# EAGLE design Backplane-3 (EAGLE 7.4.0)

## Sheet 1 of 3
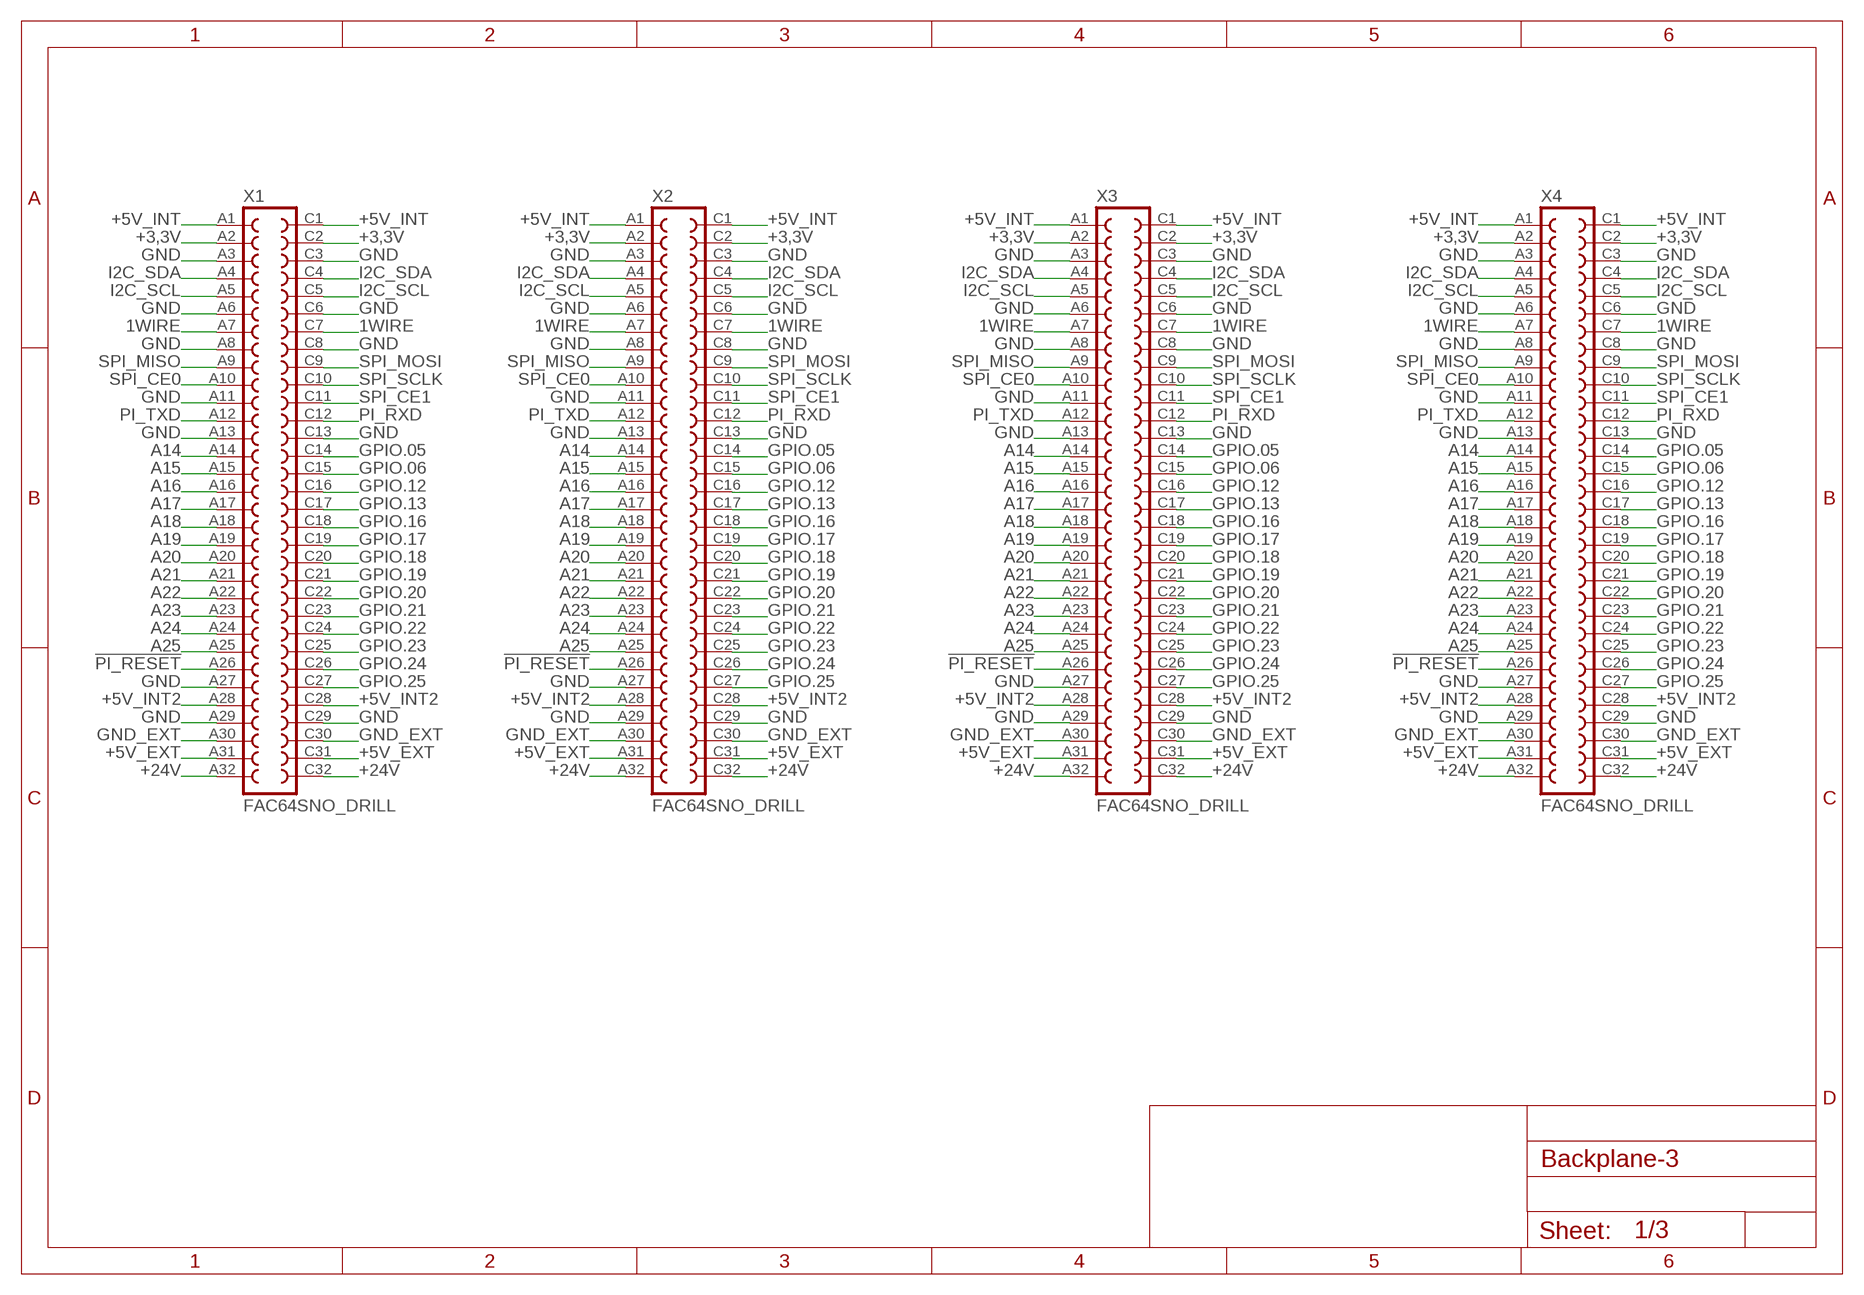
[diagram p0: schematic, sheet 1]

### Parts
X1  FAC64SNO_DRILL  [FAC64S_NO_DRILL]
X2  FAC64SNO_DRILL  [FAC64S_NO_DRILL]
X3  FAC64SNO_DRILL  [FAC64S_NO_DRILL]
X4  FAC64SNO_DRILL  [FAC64S_NO_DRILL]

### Nets
1WIRE: X1.A7 X1.C7 X2.A7 X2.C7 X3.A7 X3.C7 X4.A7 X4.C7 ; also sheet 2,3
!PI_RESET: X1.A26 X2.A26 X3.A26 X4.A26 ; also sheet 2,3
+3,3V: X1.A2 X1.C2 X2.A2 X2.C2 X3.A2 X3.C2 X4.A2 X4.C2 ; also sheet 2,3
+5V_EXT: X1.A31 X1.C31 X2.A31 X2.C31 X3.A31 X3.C31 X4.A31 X4.C31 ; also sheet 2,3
+5V_INT: X1.A1 X1.C1 X2.A1 X2.C1 X3.A1 X3.C1 X4.A1 X4.C1 ; also sheet 2,3
+5V_INT2: X1.A28 X1.C28 X2.A28 X2.C28 X3.A28 X3.C28 X4.A28 X4.C28 ; also sheet 2,3
+24V [24V]: X1.A32 X1.C32 X2.A32 X2.C32 X3.A32 X3.C32 X4.A32 X4.C32 ; also sheet 2,3
A14: X1.A14 X2.A14 X3.A14 X4.A14 ; also sheet 2,3
A15: X1.A15 X2.A15 X3.A15 X4.A15 ; also sheet 2,3
A16: X1.A16 X2.A16 X3.A16 X4.A16 ; also sheet 2,3
A17: X1.A17 X2.A17 X3.A17 X4.A17 ; also sheet 2,3
A18: X1.A18 X2.A18 X3.A18 X4.A18 ; also sheet 2,3
A19: X1.A19 X2.A19 X3.A19 X4.A19 ; also sheet 2,3
A20: X1.A20 X2.A20 X3.A20 X4.A20 ; also sheet 2,3
A21: X1.A21 X2.A21 X3.A21 X4.A21 ; also sheet 2,3
A22: X1.A22 X2.A22 X3.A22 X4.A22 ; also sheet 2,3
A23: X1.A23 X2.A23 X3.A23 X4.A23 ; also sheet 2,3
A24: X1.A24 X2.A24 X3.A24 X4.A24 ; also sheet 2,3
A25: X1.A25 X2.A25 X3.A25 X4.A25 ; also sheet 2,3
GND: X1.A3 X1.A6 X1.A8 X1.A11 X1.A13 X1.A27 X1.A29 X1.C3 X1.C6 X1.C8 X1.C13 X1.C29 X2.A3 X2.A6 X2.A8 X2.A11 X2.A13 X2.A27 X2.A29 X2.C3 X2.C6 X2.C8 X2.C13 X2.C29 X3.A3 X3.A6 X3.A8 X3.A11 X3.A13 X3.A27 X3.A29 X3.C3 X3.C6 X3.C8 X3.C13 X3.C29 X4.A3 X4.A6 X4.A8 X4.A11 X4.A13 X4.A27 X4.A29 X4.C3 X4.C6 X4.C8 X4.C13 X4.C29 ; also sheet 2,3
GND_EXT: X1.A30 X1.C30 X2.A30 X2.C30 X3.A30 X3.C30 X4.A30 X4.C30 ; also sheet 2,3
GPIO.05: X1.C14 X2.C14 X3.C14 X4.C14 ; also sheet 2,3
GPIO.06: X1.C15 X2.C15 X3.C15 X4.C15 ; also sheet 2,3
GPIO.12: X1.C16 X2.C16 X3.C16 X4.C16 ; also sheet 2,3
GPIO.13: X1.C17 X2.C17 X3.C17 X4.C17 ; also sheet 2,3
GPIO.16: X1.C18 X2.C18 X3.C18 X4.C18 ; also sheet 2,3
GPIO.17: X1.C19 X2.C19 X3.C19 X4.C19 ; also sheet 2,3
GPIO.18: X1.C20 X2.C20 X3.C20 X4.C20 ; also sheet 2,3
GPIO.19: X1.C21 X2.C21 X3.C21 X4.C21 ; also sheet 2,3
GPIO.20: X1.C22 X2.C22 X3.C22 X4.C22 ; also sheet 2,3
GPIO.21: X1.C23 X2.C23 X3.C23 X4.C23 ; also sheet 2,3
GPIO.22: X1.C24 X2.C24 X3.C24 X4.C24 ; also sheet 2,3
GPIO.23: X1.C25 X2.C25 X3.C25 X4.C25 ; also sheet 2,3
GPIO.24: X1.C26 X2.C26 X3.C26 X4.C26 ; also sheet 2,3
GPIO.25: X1.C27 X2.C27 X3.C27 X4.C27 ; also sheet 2,3
I2C_SCL: X1.A5 X1.C5 X2.A5 X2.C5 X3.A5 X3.C5 X4.A5 X4.C5 ; also sheet 2,3
I2C_SDA: X1.A4 X1.C4 X2.A4 X2.C4 X3.A4 X3.C4 X4.A4 X4.C4 ; also sheet 2,3
PI_RXD: X1.C12 X2.C12 X3.C12 X4.C12 ; also sheet 2,3
PI_TXD: X1.A12 X2.A12 X3.A12 X4.A12 ; also sheet 2,3
SPI_CE0: X1.A10 X2.A10 X3.A10 X4.A10 ; also sheet 2,3
SPI_CE1: X1.C11 X2.C11 X3.C11 X4.C11 ; also sheet 2,3
SPI_MISO: X1.A9 X2.A9 X3.A9 X4.A9 ; also sheet 2,3
SPI_MOSI: X1.C9 X2.C9 X3.C9 X4.C9 ; also sheet 2,3
SPI_SCLK: X1.C10 X2.C10 X3.C10 X4.C10 ; also sheet 2,3

## Sheet 2 of 3
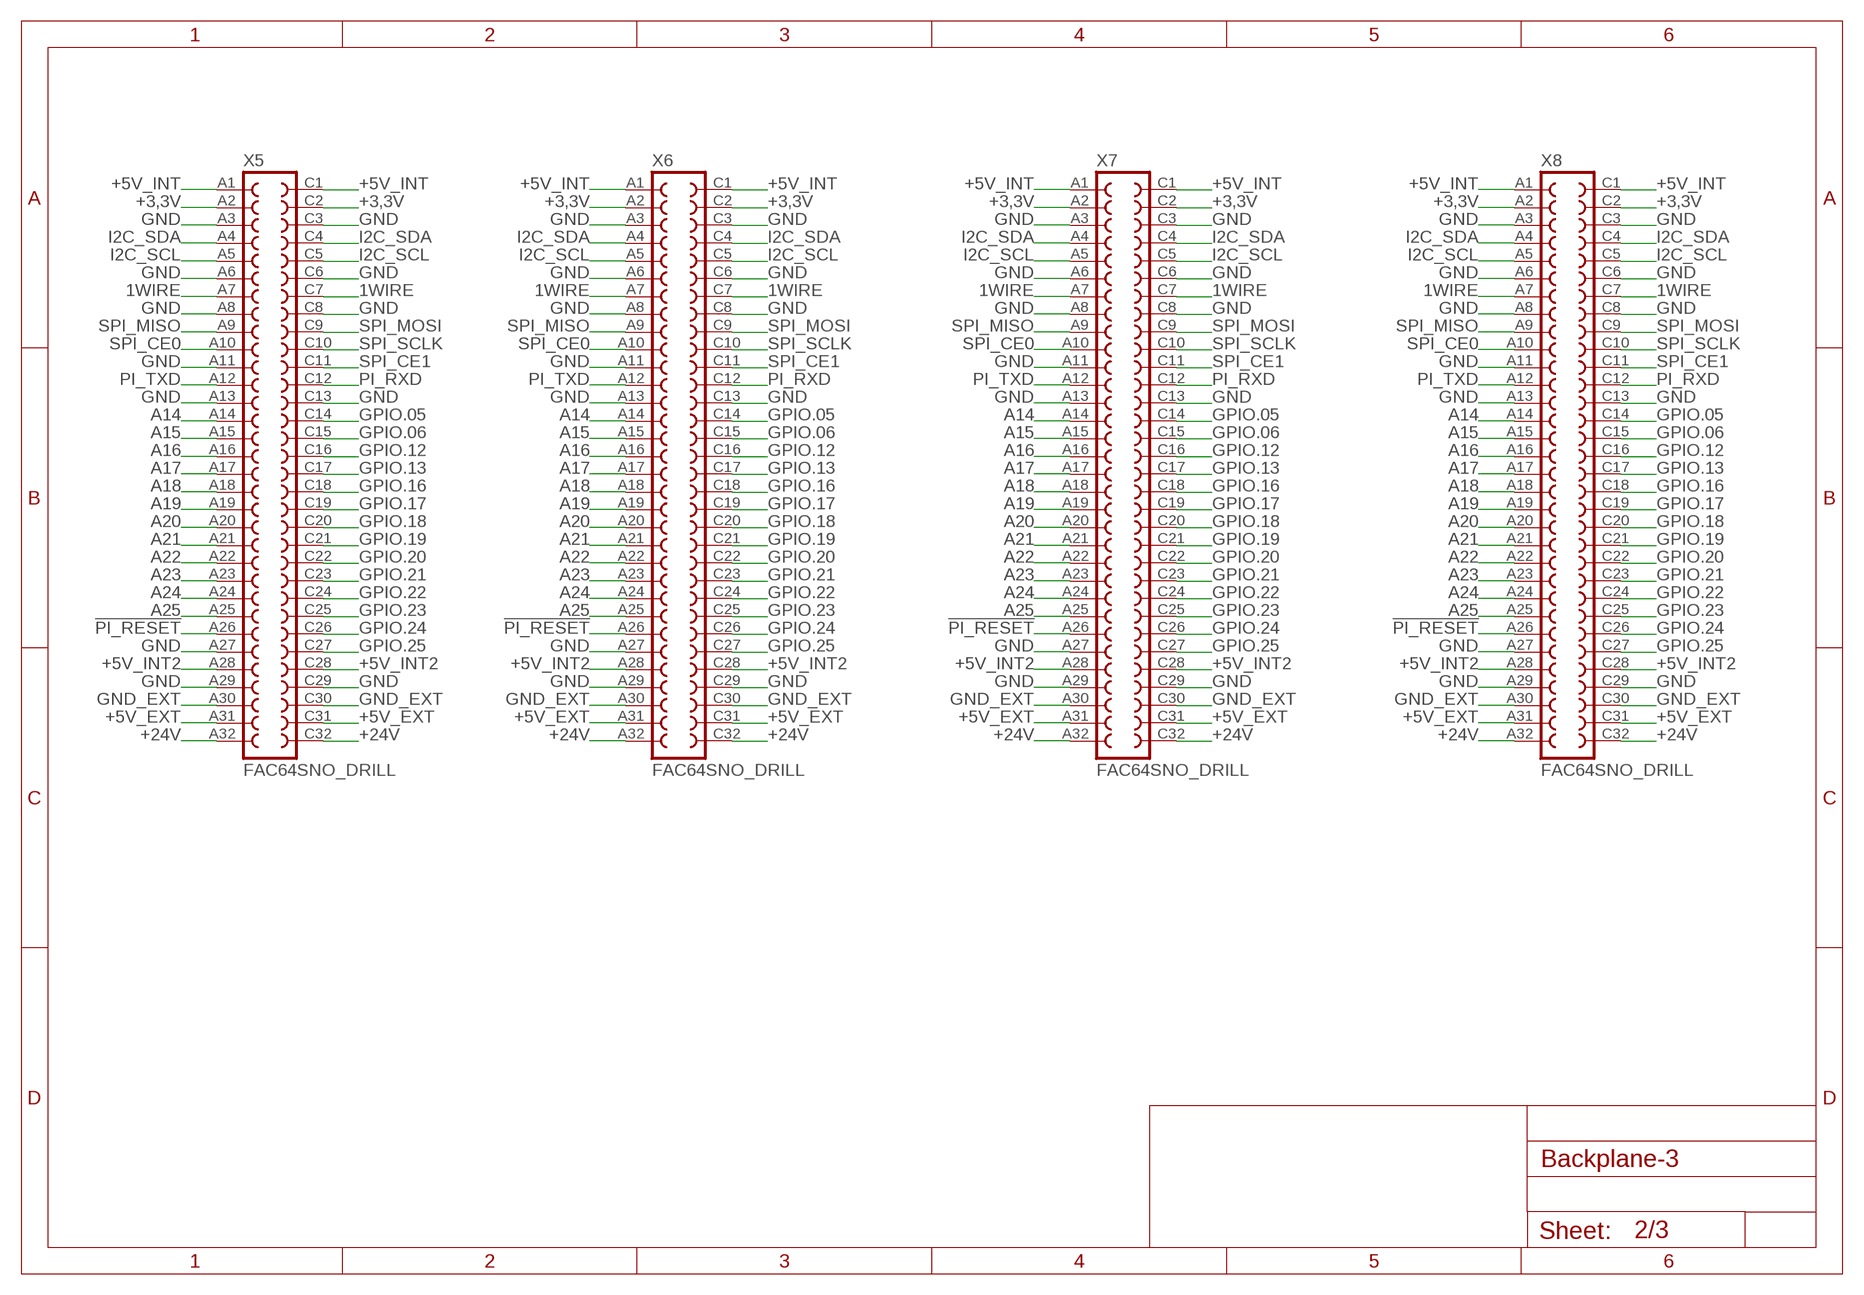
[diagram p1: schematic, sheet 2]

### Parts
X5  FAC64SNO_DRILL  [FAC64S_NO_DRILL]
X6  FAC64SNO_DRILL  [FAC64S_NO_DRILL]
X7  FAC64SNO_DRILL  [FAC64S_NO_DRILL]
X8  FAC64SNO_DRILL  [FAC64S_NO_DRILL]

### Nets
1WIRE: X5.A7 X5.C7 X6.A7 X6.C7 X7.A7 X7.C7 X8.A7 X8.C7 ; also sheet 1,3
!PI_RESET: X5.A26 X6.A26 X7.A26 X8.A26 ; also sheet 1,3
+3,3V: X5.A2 X5.C2 X6.A2 X6.C2 X7.A2 X7.C2 X8.A2 X8.C2 ; also sheet 1,3
+5V_EXT: X5.A31 X5.C31 X6.A31 X6.C31 X7.A31 X7.C31 X8.A31 X8.C31 ; also sheet 1,3
+5V_INT: X5.A1 X5.C1 X6.A1 X6.C1 X7.A1 X7.C1 X8.A1 X8.C1 ; also sheet 1,3
+5V_INT2: X5.A28 X5.C28 X6.A28 X6.C28 X7.A28 X7.C28 X8.A28 X8.C28 ; also sheet 1,3
+24V [24V]: X5.A32 X5.C32 X6.A32 X6.C32 X7.A32 X7.C32 X8.A32 X8.C32 ; also sheet 1,3
A14: X5.A14 X6.A14 X7.A14 X8.A14 ; also sheet 1,3
A15: X5.A15 X6.A15 X7.A15 X8.A15 ; also sheet 1,3
A16: X5.A16 X6.A16 X7.A16 X8.A16 ; also sheet 1,3
A17: X5.A17 X6.A17 X7.A17 X8.A17 ; also sheet 1,3
A18: X5.A18 X6.A18 X7.A18 X8.A18 ; also sheet 1,3
A19: X5.A19 X6.A19 X7.A19 X8.A19 ; also sheet 1,3
A20: X5.A20 X6.A20 X7.A20 X8.A20 ; also sheet 1,3
A21: X5.A21 X6.A21 X7.A21 X8.A21 ; also sheet 1,3
A22: X5.A22 X6.A22 X7.A22 X8.A22 ; also sheet 1,3
A23: X5.A23 X6.A23 X7.A23 X8.A23 ; also sheet 1,3
A24: X5.A24 X6.A24 X7.A24 X8.A24 ; also sheet 1,3
A25: X5.A25 X6.A25 X7.A25 X8.A25 ; also sheet 1,3
GND: X5.A3 X5.A6 X5.A8 X5.A11 X5.A13 X5.A27 X5.A29 X5.C3 X5.C6 X5.C8 X5.C13 X5.C29 X6.A3 X6.A6 X6.A8 X6.A11 X6.A13 X6.A27 X6.A29 X6.C3 X6.C6 X6.C8 X6.C13 X6.C29 X7.A3 X7.A6 X7.A8 X7.A11 X7.A13 X7.A27 X7.A29 X7.C3 X7.C6 X7.C8 X7.C13 X7.C29 X8.A3 X8.A6 X8.A8 X8.A11 X8.A13 X8.A27 X8.A29 X8.C3 X8.C6 X8.C8 X8.C13 X8.C29 ; also sheet 1,3
GND_EXT: X5.A30 X5.C30 X6.A30 X6.C30 X7.A30 X7.C30 X8.A30 X8.C30 ; also sheet 1,3
GPIO.05: X5.C14 X6.C14 X7.C14 X8.C14 ; also sheet 1,3
GPIO.06: X5.C15 X6.C15 X7.C15 X8.C15 ; also sheet 1,3
GPIO.12: X5.C16 X6.C16 X7.C16 X8.C16 ; also sheet 1,3
GPIO.13: X5.C17 X6.C17 X7.C17 X8.C17 ; also sheet 1,3
GPIO.16: X5.C18 X6.C18 X7.C18 X8.C18 ; also sheet 1,3
GPIO.17: X5.C19 X6.C19 X7.C19 X8.C19 ; also sheet 1,3
GPIO.18: X5.C20 X6.C20 X7.C20 X8.C20 ; also sheet 1,3
GPIO.19: X5.C21 X6.C21 X7.C21 X8.C21 ; also sheet 1,3
GPIO.20: X5.C22 X6.C22 X7.C22 X8.C22 ; also sheet 1,3
GPIO.21: X5.C23 X6.C23 X7.C23 X8.C23 ; also sheet 1,3
GPIO.22: X5.C24 X6.C24 X7.C24 X8.C24 ; also sheet 1,3
GPIO.23: X5.C25 X6.C25 X7.C25 X8.C25 ; also sheet 1,3
GPIO.24: X5.C26 X6.C26 X7.C26 X8.C26 ; also sheet 1,3
GPIO.25: X5.C27 X6.C27 X7.C27 X8.C27 ; also sheet 1,3
I2C_SCL: X5.A5 X5.C5 X6.A5 X6.C5 X7.A5 X7.C5 X8.A5 X8.C5 ; also sheet 1,3
I2C_SDA: X5.A4 X5.C4 X6.A4 X6.C4 X7.A4 X7.C4 X8.A4 X8.C4 ; also sheet 1,3
PI_RXD: X5.C12 X6.C12 X7.C12 X8.C12 ; also sheet 1,3
PI_TXD: X5.A12 X6.A12 X7.A12 X8.A12 ; also sheet 1,3
SPI_CE0: X5.A10 X6.A10 X7.A10 X8.A10 ; also sheet 1,3
SPI_CE1: X5.C11 X6.C11 X7.C11 X8.C11 ; also sheet 1,3
SPI_MISO: X5.A9 X6.A9 X7.A9 X8.A9 ; also sheet 1,3
SPI_MOSI: X5.C9 X6.C9 X7.C9 X8.C9 ; also sheet 1,3
SPI_SCLK: X5.C10 X6.C10 X7.C10 X8.C10 ; also sheet 1,3

## Sheet 3 of 3
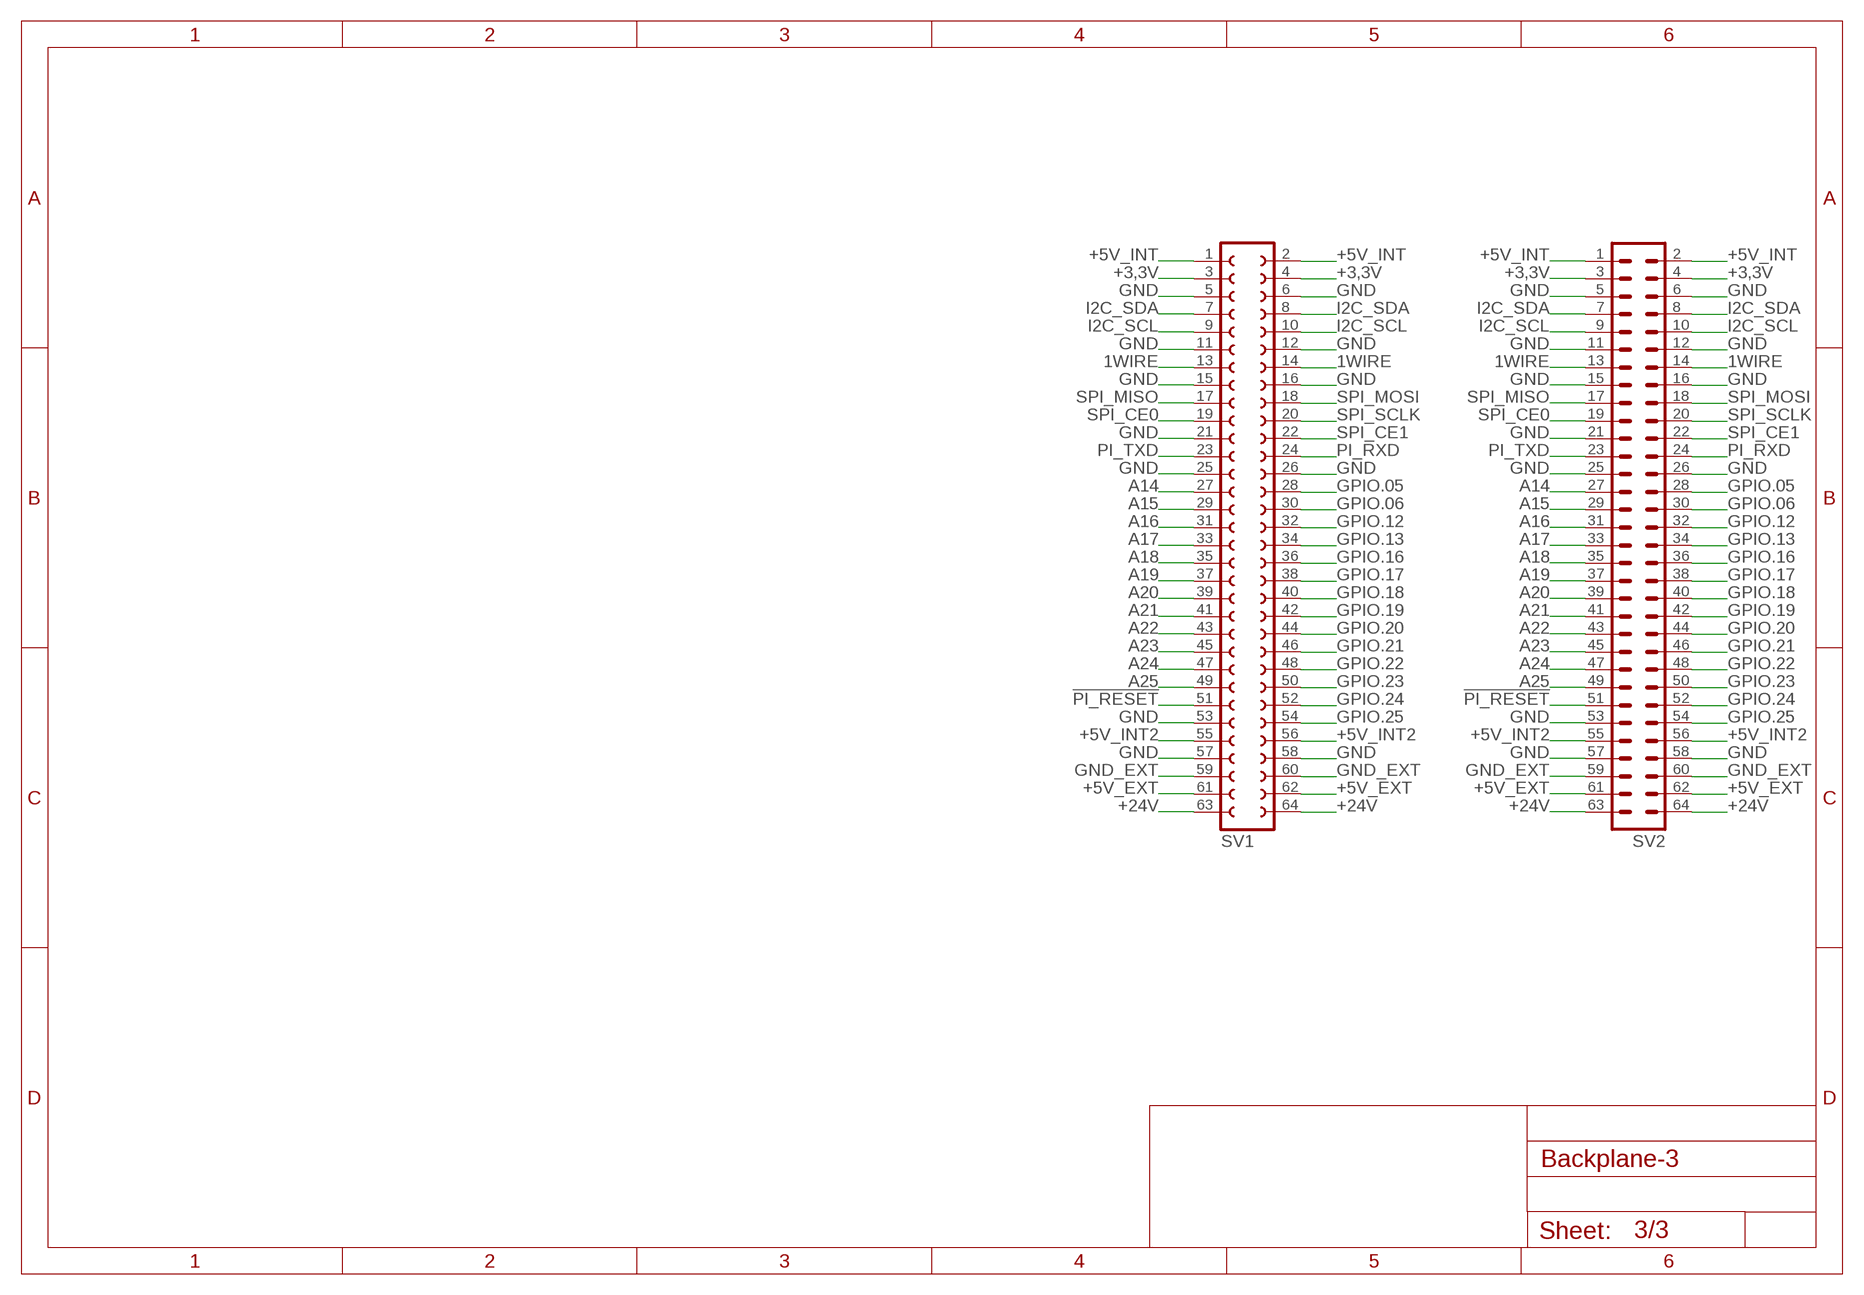
[diagram p2: schematic, sheet 3]

### Parts
SV1  FE32-2W  [FE32-2W]
SV2  MA32-2W  [MA32-2W]

### Nets
1WIRE: SV1.13 SV1.14 SV2.13 SV2.14 ; also sheet 1,2
!PI_RESET: SV1.51 SV2.51 ; also sheet 1,2
+3,3V: SV1.3 SV1.4 SV2.3 SV2.4 ; also sheet 1,2
+5V_EXT: SV1.61 SV1.62 SV2.61 SV2.62 ; also sheet 1,2
+5V_INT: SV1.1 SV1.2 SV2.1 SV2.2 ; also sheet 1,2
+5V_INT2: SV1.55 SV1.56 SV2.55 SV2.56 ; also sheet 1,2
+24V [24V]: SV1.63 SV1.64 SV2.63 SV2.64 ; also sheet 1,2
A14: SV1.27 SV2.27 ; also sheet 1,2
A15: SV1.29 SV2.29 ; also sheet 1,2
A16: SV1.31 SV2.31 ; also sheet 1,2
A17: SV1.33 SV2.33 ; also sheet 1,2
A18: SV1.35 SV2.35 ; also sheet 1,2
A19: SV1.37 SV2.37 ; also sheet 1,2
A20: SV1.39 SV2.39 ; also sheet 1,2
A21: SV1.41 SV2.41 ; also sheet 1,2
A22: SV1.43 SV2.43 ; also sheet 1,2
A23: SV1.45 SV2.45 ; also sheet 1,2
A24: SV1.47 SV2.47 ; also sheet 1,2
A25: SV1.49 SV2.49 ; also sheet 1,2
GND: SV1.5 SV1.6 SV1.11 SV1.12 SV1.15 SV1.16 SV1.21 SV1.25 SV1.26 SV1.53 SV1.57 SV1.58 SV2.5 SV2.6 SV2.11 SV2.12 SV2.15 SV2.16 SV2.21 SV2.25 SV2.26 SV2.53 SV2.57 SV2.58 ; also sheet 1,2
GND_EXT: SV1.59 SV1.60 SV2.59 SV2.60 ; also sheet 1,2
GPIO.05: SV1.28 SV2.28 ; also sheet 1,2
GPIO.06: SV1.30 SV2.30 ; also sheet 1,2
GPIO.12: SV1.32 SV2.32 ; also sheet 1,2
GPIO.13: SV1.34 SV2.34 ; also sheet 1,2
GPIO.16: SV1.36 SV2.36 ; also sheet 1,2
GPIO.17: SV1.38 SV2.38 ; also sheet 1,2
GPIO.18: SV1.40 SV2.40 ; also sheet 1,2
GPIO.19: SV1.42 SV2.42 ; also sheet 1,2
GPIO.20: SV1.44 SV2.44 ; also sheet 1,2
GPIO.21: SV1.46 SV2.46 ; also sheet 1,2
GPIO.22: SV1.48 SV2.48 ; also sheet 1,2
GPIO.23: SV1.50 SV2.50 ; also sheet 1,2
GPIO.24: SV1.52 SV2.52 ; also sheet 1,2
GPIO.25: SV1.54 SV2.54 ; also sheet 1,2
I2C_SCL: SV1.9 SV1.10 SV2.9 SV2.10 ; also sheet 1,2
I2C_SDA: SV1.7 SV1.8 SV2.7 SV2.8 ; also sheet 1,2
PI_RXD: SV1.24 SV2.24 ; also sheet 1,2
PI_TXD: SV1.23 SV2.23 ; also sheet 1,2
SPI_CE0: SV1.19 SV2.19 ; also sheet 1,2
SPI_CE1: SV1.22 SV2.22 ; also sheet 1,2
SPI_MISO: SV1.17 SV2.17 ; also sheet 1,2
SPI_MOSI: SV1.18 SV2.18 ; also sheet 1,2
SPI_SCLK: SV1.20 SV2.20 ; also sheet 1,2

## Library data of the parts
SV1 = 64-pol-verbinder:FE32-2W: FEMALE HEADER; OC_FARNELL: unknown; OC_NEWARK: unknown
SV2 = 64-pol-verbinder:MA32-2W: PIN HEADER; OC_FARNELL: unknown; OC_NEWARK: unknown
X1-X8 = my-con-vg:FAC64S: CONNECTOR female, 64 pins, block, type C, rows AC, grid 5.08 mm

## Net classes
1 24V: width 0.813 mm, clearance 0.406 mm

## Board
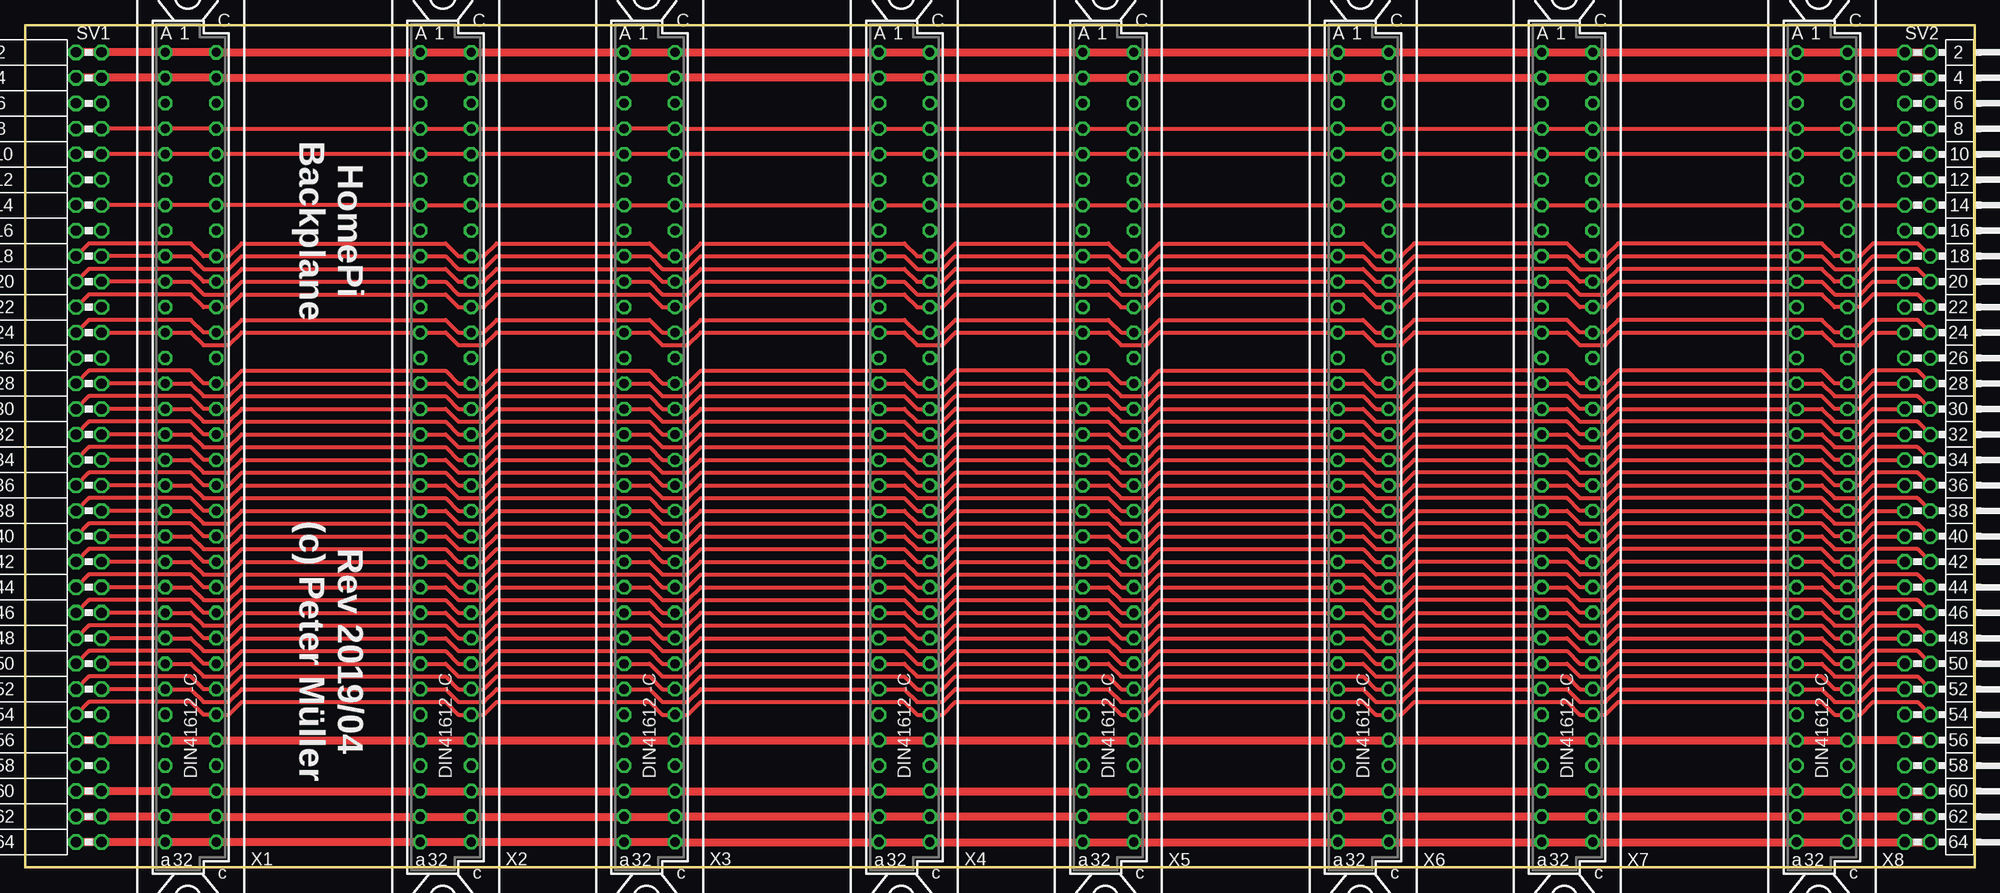
[diagram p3: board, top side]
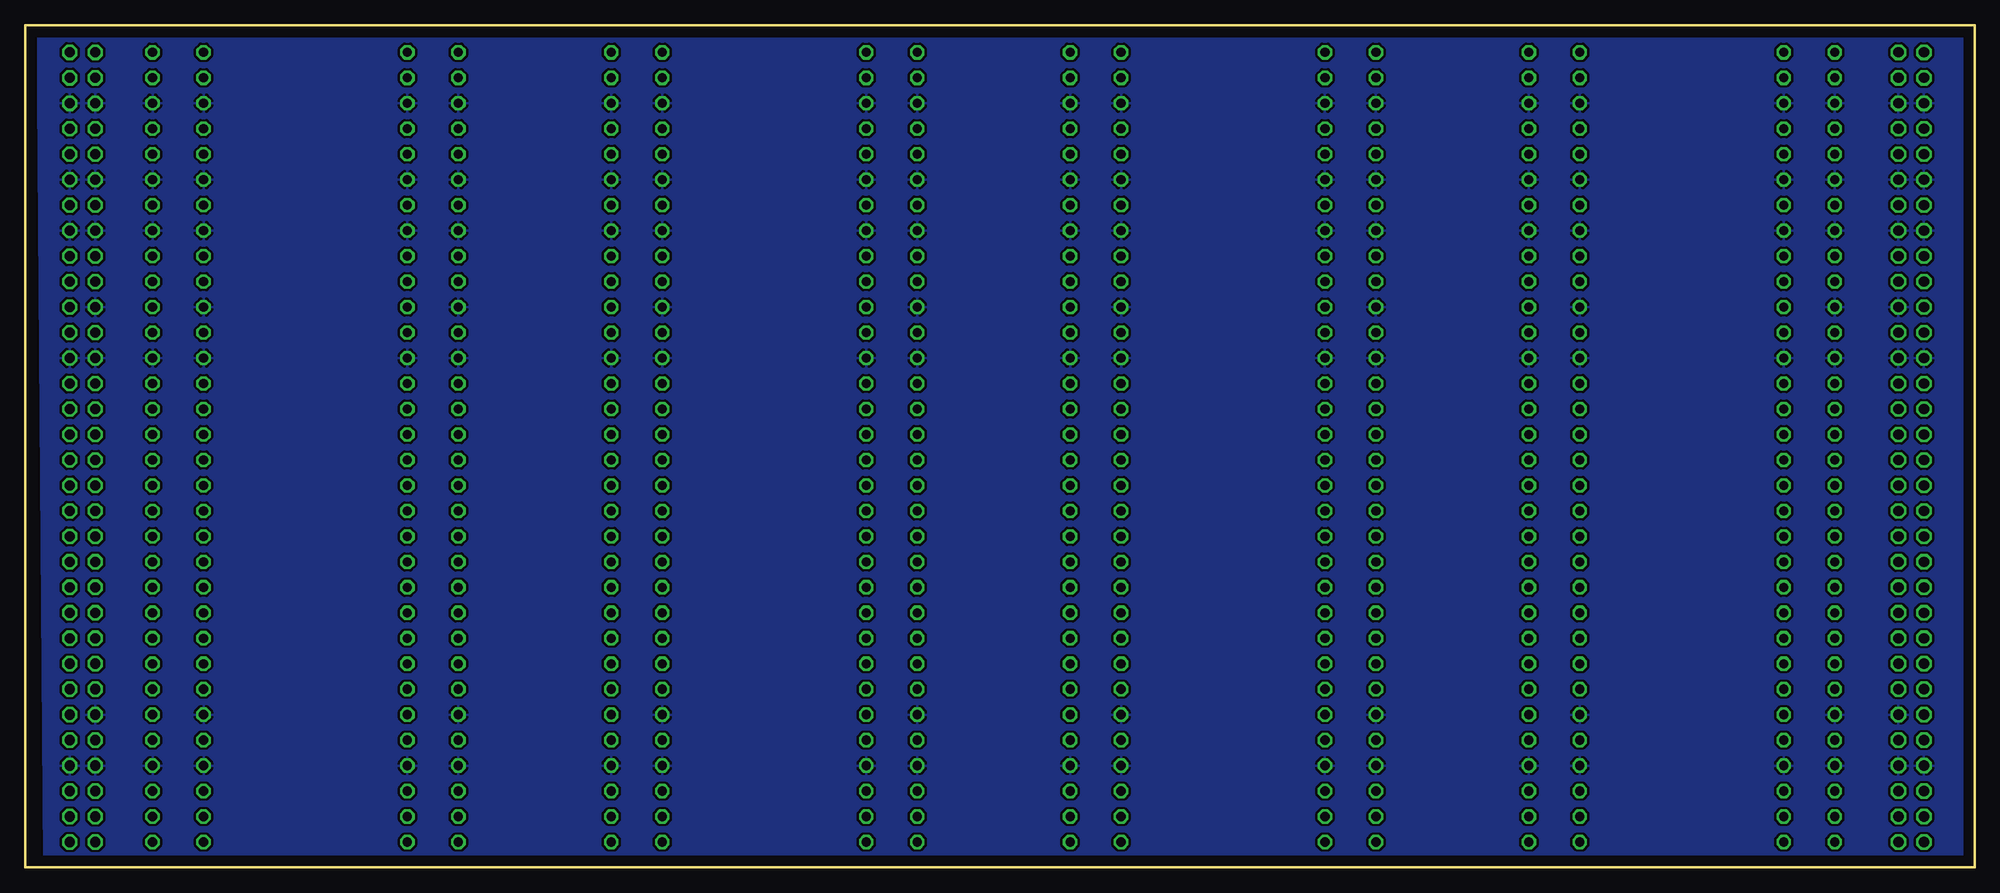
[diagram p4: board, bottom side, seen from below]

Size 194.31 x 84 mm. Coordinates in mm from the lower left corner, seen from the top.
Outline: 0,0 194.31,0 194.31,84 0,84 0,0
Copper layers (1*16): Top 0.035mm / dielectric 1.5mm / Bottom 0.035mm
Design rules "allpcb2": minimum track width 8mil, minimum drill 0.5mm, track to track 8mil, track to pad 8mil, pad to pad 8mil, via to via 8mil, smd to smd 6mil, copper to edge 40mil, drill to drill 8mil, minimum pad ring 10mil, minimum via ring 8mil, stop-mask expansion 0.1mm, vias tented up to drill 0mil, thermal gap 10mil

### Footprints (pad centres in the part's own frame; a part is rotated, then mirrored left to right if it is on the bottom)
FE32-2W = drill 1.016 octagon: 1 -36.83,1.27; 2 -36.83,-1.27; 3 -34.29,1.27; 4 -34.29,-1.27; 5 -31.75,1.27; 6 -31.75,-1.27; 7 -29.21,1.27; 8 -29.21,-1.27; 9 -26.67,1.27; 10 -26.67,-1.27; 11 -24.13,1.27; 12 -24.13,-1.27; 13 -21.59,1.27; 14 -21.59,-1.27; 15 -19.05,1.27; 16 -19.05,-1.27; 17 -16.51,1.27; 18 -16.51,-1.27; 19 -13.97,1.27; 20 -13.97,-1.27; 21 -11.43,1.27; 22 -11.43,-1.27; 23 -8.89,1.27; 24 -8.89,-1.27; 25 -6.35,1.27; 26 -6.35,-1.27; 27 -3.81,1.27; 28 -3.81,-1.27; 29 -1.27,1.27; 30 -1.27,-1.27; 31 1.27,1.27; 32 1.27,-1.27; 33 3.81,1.27; 34 3.81,-1.27; 35 6.35,1.27; 36 6.35,-1.27; 37 8.89,1.27; 38 8.89,-1.27; 39 11.43,1.27; 40 11.43,-1.27; 41 13.97,1.27; 42 13.97,-1.27; 43 16.51,1.27; 44 16.51,-1.27; 45 19.05,1.27; 46 19.05,-1.27; 47 21.59,1.27; 48 21.59,-1.27; 49 24.13,1.27; 50 24.13,-1.27; 51 26.67,1.27; 52 26.67,-1.27; 53 29.21,1.27; 54 29.21,-1.27; 55 31.75,1.27; 56 31.75,-1.27; 57 34.29,1.27; 58 34.29,-1.27; 59 36.83,1.27; 60 36.83,-1.27; 61 39.37,1.27; 62 39.37,-1.27; 63 41.91,1.27; 64 41.91,-1.27
MA32-2W = drill 1.016 octagon: 1 -36.83,-1.27; 2 -36.83,1.27; 3 -34.29,-1.27; 4 -34.29,1.27; 5 -31.75,-1.27; 6 -31.75,1.27; 7 -29.21,-1.27; 8 -29.21,1.27; 9 -26.67,-1.27; 10 -26.67,1.27; 11 -24.13,-1.27; 12 -24.13,1.27; 13 -21.59,-1.27; 14 -21.59,1.27; 15 -19.05,-1.27; 16 -19.05,1.27; 17 -16.51,-1.27; 18 -16.51,1.27; 19 -13.97,-1.27; 20 -13.97,1.27; 21 -11.43,-1.27; 22 -11.43,1.27; 23 -8.89,-1.27; 24 -8.89,1.27; 25 -6.35,-1.27; 26 -6.35,1.27; 27 -3.81,-1.27; 28 -3.81,1.27; 29 -1.27,-1.27; 30 -1.27,1.27; 31 1.27,-1.27; 32 1.27,1.27; 33 3.81,-1.27; 34 3.81,1.27; 35 6.35,-1.27; 36 6.35,1.27; 37 8.89,-1.27; 38 8.89,1.27; 39 11.43,-1.27; 40 11.43,1.27; 41 13.97,-1.27; 42 13.97,1.27; 43 16.51,-1.27; 44 16.51,1.27; 45 19.05,-1.27; 46 19.05,1.27; 47 21.59,-1.27; 48 21.59,1.27; 49 24.13,-1.27; 50 24.13,1.27; 51 26.67,-1.27; 52 26.67,1.27; 53 29.21,-1.27; 54 29.21,1.27; 55 31.75,-1.27; 56 31.75,1.27; 57 34.29,-1.27; 58 34.29,1.27; 59 36.83,-1.27; 60 36.83,1.27; 61 39.37,-1.27; 62 39.37,1.27; 63 41.91,-1.27; 64 41.91,1.27
FAC64S_NO_DRILL = drill 0.914 octagon: A1 -2.54,39.37; A2 -2.54,36.83; A3 -2.54,34.29; A4 -2.54,31.75; A5 -2.54,29.21; A6 -2.54,26.67; A7 -2.54,24.13; A8 -2.54,21.59; A9 -2.54,19.05; A10 -2.54,16.51; A11 -2.54,13.97; A12 -2.54,11.43; A13 -2.54,8.89; A14 -2.54,6.35; A15 -2.54,3.81; A16 -2.54,1.27; A17 -2.54,-1.27; A18 -2.54,-3.81; A19 -2.54,-6.35; A20 -2.54,-8.89; A21 -2.54,-11.43; A22 -2.54,-13.97; A23 -2.54,-16.51; A24 -2.54,-19.05; A25 -2.54,-21.59; A26 -2.54,-24.13; A27 -2.54,-26.67; A28 -2.54,-29.21; A29 -2.54,-31.75; A30 -2.54,-34.29; A31 -2.54,-36.83; A32 -2.54,-39.37; C1 2.54,39.37; C2 2.54,36.83; C3 2.54,34.29; C4 2.54,31.75; C5 2.54,29.21; C6 2.54,26.67; C7 2.54,24.13; C8 2.54,21.59; C9 2.54,19.05; C10 2.54,16.51; C11 2.54,13.97; C12 2.54,11.43; C13 2.54,8.89; C14 2.54,6.35; C15 2.54,3.81; C16 2.54,1.27; C17 2.54,-1.27; C18 2.54,-3.81; C19 2.54,-6.35; C20 2.54,-8.89; C21 2.54,-11.43; C22 2.54,-13.97; C23 2.54,-16.51; C24 2.54,-19.05; C25 2.54,-21.59; C26 2.54,-24.13; C27 2.54,-26.67; C28 2.54,-29.21; C29 2.54,-31.75; C30 2.54,-34.29; C31 2.54,-36.83; C32 2.54,-39.37

### Placement (x,y rotation side)
SV1  6.35,44.45 270 top
SV2  188.59,44.45 270 top
X1  16.51,41.91 0 top
X2  41.91,41.91 0 top
X3  62.23,41.91 0 top
X4  87.63,41.91 0 top
X5  107.95,41.91 0 top
X6  133.35,41.91 0 top
X7  153.67,41.91 0 top
X8  179.07,41.91 0 top

### Tracks (layer width: path | path; a pad name or v marks a point on that pad's centre or on a via)
1WIRE
  Top 0.406: SV1.14 SV1.13 X1.A7 X1.C7 X2.A7 X2.C7 X3.A7 X3.C7 X4.A7 X4.C7 X5.A7 X5.C7 X6.A7 X6.C7 X7.A7 X7.C7 X8.A7 X8.C7 SV2.13 SV2.14
!PI_RESET
  Top 0.406: SV1.51 X1.A26 16.51,17.78 17.78,16.51 20.32,16.51 21.59,17.78 X2.A26 41.91,17.78 43.18,16.51 45.72,16.51 46.99,17.78 X3.A26 62.23,17.78 63.5,16.51 66.04,16.51 67.31,17.78 X4.A26 87.63,17.78 88.9,16.51 91.44,16.51 92.71,17.78 X5.A26 107.95,17.78 109.22,16.51 111.76,16.51 113.03,17.78 X6.A26 133.35,17.78 134.62,16.51 137.16,16.51 138.43,17.78 X7.A26 153.67,17.78 154.94,16.51 157.48,16.51 158.75,17.78 X8.A26 179.07,17.78 180.34,16.51 182.88,16.51 184.15,17.78 SV2.51
+3,3V
  Top 0.813: X4.C2 X4.A2 X3.C2 X3.A2 X2.C2 X2.A2 X1.C2 X1.A2 SV1.3 SV1.4 | SV2.4 SV2.3 X8.C2 X8.A2 X7.C2 X7.A2 X6.C2 X6.A2 X5.C2 X4.C2 | X4.C2 X5.A2
+5V_EXT
  Top 0.813: SV1.62 SV1.61 X1.A31 X1.C31 X2.A31 X2.C31 X3.A31 X3.C31 X4.A31 X4.C31 X5.A31 X5.C31 X6.A31 X6.C31 X7.A31 X7.C31 X8.A31 X8.C31 SV2.61 SV2.62
+5V_INT
  Top 0.813: X4.C1 X4.A1 X3.C1 X3.A1 X2.C1 X2.A1 X1.C1 X1.A1 SV1.1 SV1.2 | SV2.2 SV2.1 X8.C1 X8.A1 X7.C1 X7.A1 X6.C1 X6.A1 X4.C1 | X4.C1 X5.A1 X5.C1
+5V_INT2
  Top 0.813: SV1.56 SV1.55 X1.A28 X1.C28 X2.A28 X2.C28 X3.A28 X3.C28 X4.A28 X4.C28 X5.A28 X5.C28 X6.A28 X6.C28 X7.A28 X7.C28 X8.A28 X8.C28 SV2.55 SV2.56
+24V
  Top 0.813: SV1.64 SV1.63 X1.A32 X1.C32 X2.A32 X2.C32 X3.A32 X3.C32 X4.A32 X4.C32 X5.A32 X5.C32 X6.A32 X6.C32 X7.A32 X7.C32 X8.A32 X8.C32 SV2.63 SV2.64
A14
  Top 0.406: SV1.27 X1.A14 16.51,48.26 17.78,46.99 20.32,46.99 21.59,48.26 X2.A14 41.91,48.26 43.18,46.99 45.72,46.99 46.99,48.26 X3.A14 62.23,48.26 63.5,46.99 66.04,46.99 67.31,48.26 X4.A14 87.63,48.26 88.9,46.99 91.44,46.99 92.71,48.26 X5.A14 107.95,48.26 109.22,46.99 111.76,46.99 113.03,48.26 X6.A14 133.35,48.26 134.62,46.99 137.16,46.99 138.43,48.26 X7.A14 153.67,48.26 154.94,46.99 157.48,46.99 158.75,48.26 X8.A14 179.07,48.26 180.34,46.99 182.88,46.99 184.15,48.26 SV2.27
A15
  Top 0.406: SV1.29 X1.A15 16.51,45.72 17.78,44.45 20.32,44.45 21.59,45.72 X2.A15 41.91,45.72 43.18,44.45 45.72,44.45 46.99,45.72 X3.A15 62.23,45.72 63.5,44.45 66.04,44.45 67.31,45.72 X4.A15 87.63,45.72 88.9,44.45 91.44,44.45 92.71,45.72 X5.A15 107.95,45.72 109.22,44.45 111.76,44.45 113.03,45.72 X6.A15 133.35,45.72 134.62,44.45 137.16,44.45 138.43,45.72 X7.A15 153.67,45.72 154.94,44.45 157.48,44.45 158.75,45.72 X8.A15 179.07,45.72 180.34,44.45 182.88,44.45 184.15,45.72 SV2.29
A16
  Top 0.406: SV1.31 X1.A16 16.51,43.18 17.78,41.91 20.32,41.91 21.59,43.18 X2.A16 41.91,43.18 43.18,41.91 45.72,41.91 46.99,43.18 X3.A16 62.23,43.18 63.5,41.91 66.04,41.91 67.31,43.18 X4.A16 87.63,43.18 88.9,41.91 91.44,41.91 92.71,43.18 X5.A16 107.95,43.18 109.22,41.91 111.76,41.91 113.03,43.18 X6.A16 133.35,43.18 134.62,41.91 137.16,41.91 138.43,43.18 X7.A16 153.67,43.18 154.94,41.91 157.48,41.91 158.75,43.18 X8.A16 179.07,43.18 180.34,41.91 182.88,41.91 184.15,43.18 SV2.31
A17
  Top 0.406: SV1.33 X1.A17 16.51,40.64 17.78,39.37 20.32,39.37 21.59,40.64 X2.A17 41.91,40.64 43.18,39.37 45.72,39.37 46.99,40.64 X3.A17 62.23,40.64 63.5,39.37 66.04,39.37 67.31,40.64 X4.A17 87.63,40.64 88.9,39.37 91.44,39.37 92.71,40.64 X5.A17 107.95,40.64 109.22,39.37 111.76,39.37 113.03,40.64 X6.A17 133.35,40.64 134.62,39.37 137.16,39.37 138.43,40.64 X7.A17 153.67,40.64 154.94,39.37 157.48,39.37 158.75,40.64 X8.A17 179.07,40.64 180.34,39.37 182.88,39.37 184.15,40.64 SV2.33
A18
  Top 0.406: SV1.35 X1.A18 16.51,38.1 17.78,36.83 20.32,36.83 21.59,38.1 X2.A18 41.91,38.1 43.18,36.83 45.72,36.83 46.99,38.1 X3.A18 62.23,38.1 63.5,36.83 66.04,36.83 67.31,38.1 X4.A18 87.63,38.1 88.9,36.83 91.44,36.83 92.71,38.1 X5.A18 107.95,38.1 109.22,36.83 111.76,36.83 113.03,38.1 X6.A18 133.35,38.1 134.62,36.83 137.16,36.83 138.43,38.1 X7.A18 153.67,38.1 154.94,36.83 157.48,36.83 158.75,38.1 X8.A18 179.07,38.1 180.34,36.83 182.88,36.83 184.15,38.1 SV2.35
A19
  Top 0.406: SV1.37 X1.A19 16.51,35.56 17.78,34.29 20.32,34.29 21.59,35.56 X2.A19 41.91,35.56 43.18,34.29 45.72,34.29 46.99,35.56 X3.A19 62.23,35.56 63.5,34.29 66.04,34.29 67.31,35.56 X4.A19 87.63,35.56 88.9,34.29 91.44,34.29 92.71,35.56 X5.A19 107.95,35.56 109.22,34.29 111.76,34.29 113.03,35.56 X6.A19 133.35,35.56 134.62,34.29 137.16,34.29 138.43,35.56 X7.A19 153.67,35.56 154.94,34.29 157.48,34.29 158.75,35.56 X8.A19 179.07,35.56 180.34,34.29 182.88,34.29 184.15,35.56 SV2.37
A20
  Top 0.406: SV1.39 X1.A20 16.51,33.02 17.78,31.75 20.32,31.75 21.59,33.02 X2.A20 41.91,33.02 43.18,31.75 45.72,31.75 46.99,33.02 X3.A20 62.23,33.02 63.5,31.75 66.04,31.75 67.31,33.02 X4.A20 87.63,33.02 88.9,31.75 91.44,31.75 92.71,33.02 X5.A20 107.95,33.02 109.22,31.75 111.76,31.75 113.03,33.02 X6.A20 133.35,33.02 134.62,31.75 137.16,31.75 138.43,33.02 X7.A20 153.67,33.02 154.94,31.75 157.48,31.75 158.75,33.02 X8.A20 179.07,33.02 180.34,31.75 182.88,31.75 184.15,33.02 SV2.39
A21
  Top 0.406: SV1.41 X1.A21 16.51,30.48 17.78,29.21 20.32,29.21 21.59,30.48 X2.A21 41.91,30.48 43.18,29.21 45.72,29.21 46.99,30.48 X3.A21 62.23,30.48 63.5,29.21 66.04,29.21 67.31,30.48 X4.A21 87.63,30.48 88.9,29.21 91.44,29.21 92.71,30.48 X5.A21 107.95,30.48 109.22,29.21 111.76,29.21 113.03,30.48 X6.A21 133.35,30.48 134.62,29.21 137.16,29.21 138.43,30.48 X7.A21 153.67,30.48 154.94,29.21 157.48,29.21 158.75,30.48 X8.A21 179.07,30.48 180.34,29.21 182.88,29.21 184.15,30.48 SV2.41
A22
  Top 0.406: SV1.43 X1.A22 16.51,27.94 17.78,26.67 20.32,26.67 21.59,27.94 X2.A22 41.91,27.94 43.18,26.67 45.72,26.67 46.99,27.94 X3.A22 62.23,27.94 63.5,26.67 66.04,26.67 67.31,27.94 X4.A22 87.63,27.94 88.9,26.67 91.44,26.67 92.71,27.94 X5.A22 107.95,27.94 109.22,26.67 111.76,26.67 113.03,27.94 X6.A22 133.35,27.94 134.62,26.67 137.16,26.67 138.43,27.94 X7.A22 153.67,27.94 154.94,26.67 157.48,26.67 158.75,27.94 X8.A22 179.07,27.94 180.34,26.67 182.88,26.67 184.15,27.94 SV2.43
A23
  Top 0.406: SV1.45 X1.A23 16.51,25.4 17.78,24.13 20.32,24.13 21.59,25.4 X2.A23 41.91,25.4 43.18,24.13 45.72,24.13 46.99,25.4 X3.A23 62.23,25.4 63.5,24.13 66.04,24.13 67.31,25.4 X4.A23 87.63,25.4 88.9,24.13 91.44,24.13 92.71,25.4 X5.A23 107.95,25.4 109.22,24.13 111.76,24.13 113.03,25.4 X6.A23 133.35,25.4 134.62,24.13 137.16,24.13 138.43,25.4 X7.A23 153.67,25.4 154.94,24.13 157.48,24.13 158.75,25.4 X8.A23 179.07,25.4 180.34,24.13 182.88,24.13 184.15,25.4 SV2.45
A24
  Top 0.406: SV1.47 X1.A24 16.51,22.86 17.78,21.59 20.32,21.59 21.59,22.86 X2.A24 41.91,22.86 43.18,21.59 45.72,21.59 46.99,22.86 X3.A24 62.23,22.86 63.5,21.59 66.04,21.59 67.31,22.86 X4.A24 87.63,22.86 88.9,21.59 91.44,21.59 92.71,22.86 X5.A24 107.95,22.86 109.22,21.59 111.76,21.59 113.03,22.86 X6.A24 133.35,22.86 134.62,21.59 137.16,21.59 138.43,22.86 X7.A24 153.67,22.86 154.94,21.59 157.48,21.59 158.75,22.86 X8.A24 179.07,22.86 180.34,21.59 182.88,21.59 184.15,22.86 SV2.47
A25
  Top 0.406: SV1.49 X1.A25 16.51,20.32 17.78,19.05 20.32,19.05 21.59,20.32 X2.A25 41.91,20.32 43.18,19.05 45.72,19.05 46.99,20.32 X3.A25 62.23,20.32 63.5,19.05 66.04,19.05 67.31,20.32 X4.A25 87.63,20.32 88.9,19.05 91.44,19.05 92.71,20.32 X5.A25 107.95,20.32 109.22,19.05 111.76,19.05 113.03,20.32 X6.A25 133.35,20.32 134.62,19.05 137.16,19.05 138.43,20.32 X7.A25 153.67,20.32 154.94,19.05 157.48,19.05 158.75,20.32 X8.A25 179.07,20.32 180.34,19.05 182.88,19.05 184.15,20.32 SV2.49
GND
  pour Bottom (isolate 0.254): 1.27,83.19 193.04,83.19 192.41,0.64 1.27,0.64
GND_EXT
  Top 0.813: SV1.60 SV1.59 X1.A30 X1.C30 X2.A30 X2.C30 X3.A30 X3.C30 X4.A30 X4.C30 X5.A30 X5.C30 X6.A30 X6.C30 X7.A30 X7.C30 X8.A30 X8.C30 SV2.59 SV2.60
GPIO.05
  Top 0.406: SV1.28 6.35,49.53 16.51,49.53 17.78,48.26 X1.C14 20.32,48.26 21.59,49.53 41.91,49.53 43.18,48.26 X2.C14 45.72,48.26 46.99,49.53 62.23,49.53 63.5,48.26 X3.C14 66.04,48.26 67.31,49.53 87.63,49.53 88.9,48.26 X4.C14 91.44,48.26 92.71,49.53 107.95,49.53 109.22,48.26 X5.C14 111.76,48.26 113.03,49.53 133.35,49.53 134.62,48.26 X6.C14 137.16,48.26 138.43,49.53 153.67,49.53 154.94,48.26 X7.C14 157.48,48.26 158.75,49.53 179.07,49.53 180.34,48.26 X8.C14 182.88,48.26 184.15,49.53 188.59,49.53 SV2.28
GPIO.06
  Top 0.406: SV1.30 6.35,46.99 16.51,46.99 17.78,45.72 X1.C15 20.32,45.72 21.59,46.99 41.91,46.99 43.18,45.72 X2.C15 45.72,45.72 46.99,46.99 62.23,46.99 63.5,45.72 X3.C15 66.04,45.72 67.31,46.99 87.63,46.99 88.9,45.72 X4.C15 91.44,45.72 92.71,46.99 107.95,46.99 109.22,45.72 X5.C15 111.76,45.72 113.03,46.99 133.35,46.99 134.62,45.72 X6.C15 137.16,45.72 138.43,46.99 153.67,46.99 154.94,45.72 X7.C15 157.48,45.72 158.75,46.99 179.07,46.99 180.34,45.72 X8.C15 182.88,45.72 184.15,46.99 188.59,46.99 SV2.30
GPIO.12
  Top 0.406: SV1.32 6.35,44.45 16.51,44.45 17.78,43.18 X1.C16 20.32,43.18 21.59,44.45 41.91,44.45 43.18,43.18 X2.C16 45.72,43.18 46.99,44.45 62.23,44.45 63.5,43.18 X3.C16 66.04,43.18 67.31,44.45 87.63,44.45 88.9,43.18 X4.C16 91.44,43.18 92.71,44.45 107.95,44.45 109.22,43.18 X5.C16 111.76,43.18 113.03,44.45 133.35,44.45 134.62,43.18 X6.C16 137.16,43.18 138.43,44.45 153.67,44.45 154.94,43.18 X7.C16 157.48,43.18 158.75,44.45 179.07,44.45 180.34,43.18 X8.C16 182.88,43.18 184.15,44.45 188.59,44.45 SV2.32
GPIO.13
  Top 0.406: SV1.34 6.35,41.91 16.51,41.91 17.78,40.64 X1.C17 20.32,40.64 21.59,41.91 41.91,41.91 43.18,40.64 X2.C17 45.72,40.64 46.99,41.91 62.23,41.91 63.5,40.64 X3.C17 66.04,40.64 67.31,41.91 87.63,41.91 88.9,40.64 X4.C17 91.44,40.64 92.71,41.91 107.95,41.91 109.22,40.64 X5.C17 111.76,40.64 113.03,41.91 133.35,41.91 134.62,40.64 X6.C17 137.16,40.64 138.43,41.91 153.67,41.91 154.94,40.64 X7.C17 157.48,40.64 158.75,41.91 179.07,41.91 180.34,40.64 X8.C17 182.88,40.64 184.15,41.91 188.59,41.91 SV2.34
GPIO.16
  Top 0.406: SV1.36 6.35,39.37 16.51,39.37 17.78,38.1 X1.C18 20.32,38.1 21.59,39.37 41.91,39.37 43.18,38.1 X2.C18 45.72,38.1 46.99,39.37 62.23,39.37 63.5,38.1 X3.C18 66.04,38.1 67.31,39.37 87.63,39.37 88.9,38.1 X4.C18 91.44,38.1 92.71,39.37 107.95,39.37 109.22,38.1 X5.C18 111.76,38.1 113.03,39.37 133.35,39.37 134.62,38.1 X6.C18 137.16,38.1 138.43,39.37 153.67,39.37 154.94,38.1 X7.C18 157.48,38.1 158.75,39.37 179.07,39.37 180.34,38.1 X8.C18 182.88,38.1 184.15,39.37 188.59,39.37 SV2.36
GPIO.17
  Top 0.406: SV1.38 6.35,36.83 16.51,36.83 17.78,35.56 X1.C19 20.32,35.56 21.59,36.83 41.91,36.83 43.18,35.56 X2.C19 45.72,35.56 46.99,36.83 62.23,36.83 63.5,35.56 X3.C19 66.04,35.56 67.31,36.83 87.63,36.83 88.9,35.56 X4.C19 91.44,35.56 92.71,36.83 107.95,36.83 109.22,35.56 X5.C19 111.76,35.56 113.03,36.83 133.35,36.83 134.62,35.56 X6.C19 137.16,35.56 138.43,36.83 153.67,36.83 154.94,35.56 X7.C19 157.48,35.56 158.75,36.83 179.07,36.83 180.34,35.56 X8.C19 182.88,35.56 184.15,36.83 188.59,36.83 SV2.38
GPIO.18
  Top 0.406: SV1.40 6.35,34.29 16.51,34.29 17.78,33.02 X1.C20 20.32,33.02 21.59,34.29 41.91,34.29 43.18,33.02 X2.C20 45.72,33.02 46.99,34.29 62.23,34.29 63.5,33.02 X3.C20 66.04,33.02 67.31,34.29 87.63,34.29 88.9,33.02 X4.C20 91.44,33.02 92.71,34.29 107.95,34.29 109.22,33.02 X5.C20 111.76,33.02 113.03,34.29 133.35,34.29 134.62,33.02 X6.C20 137.16,33.02 138.43,34.29 153.67,34.29 154.94,33.02 X7.C20 157.48,33.02 158.75,34.29 179.07,34.29 180.34,33.02 X8.C20 182.88,33.02 184.15,34.29 188.59,34.29 SV2.40
GPIO.19
  Top 0.406: SV1.42 6.35,31.75 16.51,31.75 17.78,30.48 X1.C21 20.32,30.48 21.59,31.75 41.91,31.75 43.18,30.48 X2.C21 45.72,30.48 46.99,31.75 62.23,31.75 63.5,30.48 X3.C21 66.04,30.48 67.31,31.75 87.63,31.75 88.9,30.48 X4.C21 91.44,30.48 92.71,31.75 107.95,31.75 109.22,30.48 X5.C21 111.76,30.48 113.03,31.75 133.35,31.75 134.62,30.48 X6.C21 137.16,30.48 138.43,31.75 153.67,31.75 154.94,30.48 X7.C21 157.48,30.48 158.75,31.75 179.07,31.75 180.34,30.48 X8.C21 182.88,30.48 184.15,31.75 188.59,31.75 SV2.42
GPIO.20
  Top 0.406: SV1.44 6.35,29.21 16.51,29.21 17.78,27.94 X1.C22 20.32,27.94 21.59,29.21 41.91,29.21 43.18,27.94 X2.C22 45.72,27.94 46.99,29.21 62.23,29.21 63.5,27.94 X3.C22 66.04,27.94 67.31,29.21 87.63,29.21 88.9,27.94 X4.C22 91.44,27.94 92.71,29.21 107.95,29.21 109.22,27.94 X5.C22 111.76,27.94 113.03,29.21 133.35,29.21 134.62,27.94 X6.C22 137.16,27.94 138.43,29.21 153.67,29.21 154.94,27.94 X7.C22 157.48,27.94 158.75,29.21 179.07,29.21 180.34,27.94 X8.C22 182.88,27.94 184.15,29.21 188.59,29.21 SV2.44
GPIO.21
  Top 0.406: SV1.46 6.35,26.67 16.51,26.67 17.78,25.4 X1.C23 20.32,25.4 21.59,26.67 41.91,26.67 43.18,25.4 X2.C23 45.72,25.4 46.99,26.67 62.23,26.67 63.5,25.4 X3.C23 66.04,25.4 67.31,26.67 87.63,26.67 88.9,25.4 X4.C23 91.44,25.4 92.71,26.67 107.95,26.67 109.22,25.4 X5.C23 111.76,25.4 113.03,26.67 133.35,26.67 134.62,25.4 X6.C23 137.16,25.4 138.43,26.67 153.67,26.67 154.94,25.4 X7.C23 157.48,25.4 158.75,26.67 179.07,26.67 180.34,25.4 X8.C23 182.88,25.4 184.15,26.67 188.59,26.67 SV2.46
GPIO.22
  Top 0.406: SV1.48 6.35,24.13 16.51,24.13 17.78,22.86 X1.C24 20.32,22.86 21.59,24.13 41.91,24.13 43.18,22.86 X2.C24 45.72,22.86 46.99,24.13 62.23,24.13 63.5,22.86 X3.C24 66.04,22.86 67.31,24.13 87.63,24.13 88.9,22.86 X4.C24 91.44,22.86 92.71,24.13 107.95,24.13 109.22,22.86 X5.C24 111.76,22.86 113.03,24.13 133.35,24.13 134.62,22.86 X6.C24 137.16,22.86 138.43,24.13 153.67,24.13 154.94,22.86 X7.C24 157.48,22.86 158.75,24.13 179.07,24.13 180.34,22.86 X8.C24 182.88,22.86 184.15,24.13 188.59,24.13 SV2.48
GPIO.23
  Top 0.406: SV1.50 6.35,21.59 16.51,21.59 17.78,20.32 X1.C25 20.32,20.32 21.59,21.59 41.91,21.59 43.18,20.32 X2.C25 45.72,20.32 46.99,21.59 62.23,21.59 63.5,20.32 X3.C25 66.04,20.32 67.31,21.59 87.63,21.59 88.9,20.32 X4.C25 91.44,20.32 92.71,21.59 107.95,21.59 109.22,20.32 X5.C25 111.76,20.32 113.03,21.59 133.35,21.59 134.62,20.32 X6.C25 137.16,20.32 138.43,21.59 153.67,21.59 154.94,20.32 X7.C25 157.48,20.32 158.75,21.59 179.07,21.59 180.34,20.32 X8.C25 182.88,20.32 184.15,21.59 188.59,21.59 SV2.50
GPIO.24
  Top 0.406: SV1.52 6.35,19.05 16.51,19.05 17.78,17.78 X1.C26 20.32,17.78 21.59,19.05 41.91,19.05 43.18,17.78 X2.C26 45.72,17.78 46.99,19.05 62.23,19.05 63.5,17.78 X3.C26 66.04,17.78 67.31,19.05 87.63,19.05 88.9,17.78 X4.C26 91.44,17.78 92.71,19.05 107.95,19.05 109.22,17.78 X5.C26 111.76,17.78 113.03,19.05 133.35,19.05 134.62,17.78 X6.C26 137.16,17.78 138.43,19.05 153.67,19.05 154.94,17.78 X7.C26 157.48,17.78 158.75,19.05 179.07,19.05 180.34,17.78 X8.C26 182.88,17.78 184.15,19.05 188.59,19.05 SV2.52
GPIO.25
  Top 0.406: SV1.54 6.35,16.51 16.51,16.51 17.78,15.24 X1.C27 20.32,15.24 21.59,16.51 41.91,16.51 43.18,15.24 X2.C27 45.72,15.24 46.99,16.51 62.23,16.51 63.5,15.24 X3.C27 66.04,15.24 67.31,16.51 87.63,16.51 88.9,15.24 X4.C27 91.44,15.24 92.71,16.51 107.95,16.51 109.22,15.24 X5.C27 111.76,15.24 113.03,16.51 133.35,16.51 134.62,15.24 X6.C27 137.16,15.24 138.43,16.51 153.67,16.51 154.94,15.24 X7.C27 157.48,15.24 158.75,16.51 179.07,16.51 180.34,15.24 X8.C27 182.88,15.24 184.15,16.51 188.59,16.51 SV2.54
I2C_SCL
  Top 0.406: SV1.10 SV1.9 X1.A5 X1.C5 X2.A5 X2.C5 X3.A5 X3.C5 X4.A5 X4.C5 X5.A5 X5.C5 X6.A5 X6.C5 X7.A5 X7.C5 X8.A5 X8.C5 SV2.9 SV2.10
I2C_SDA
  Top 0.406: SV1.8 SV1.7 X1.A4 X1.C4 X2.A4 X2.C4 X3.A4 X3.C4 X4.A4 X4.C4 X5.A4 X5.C4 X6.A4 X6.C4 X7.A4 X7.C4 X8.A4 X8.C4 SV2.7 SV2.8
PI_RXD
  Top 0.406: SV1.24 6.35,54.61 16.51,54.61 17.78,53.34 X1.C12 20.32,53.34 21.59,54.61 41.91,54.61 43.18,53.34 X2.C12 45.72,53.34 46.99,54.61 62.23,54.61 63.5,53.34 X3.C12 66.04,53.34 67.31,54.61 87.63,54.61 88.9,53.34 X4.C12 91.44,53.34 92.71,54.61 107.95,54.61 109.22,53.34 X5.C12 111.76,53.34 113.03,54.61 133.35,54.61 134.62,53.34 X6.C12 137.16,53.34 138.43,54.61 153.67,54.61 154.94,53.34 X7.C12 157.48,53.34 158.75,54.61 179.07,54.61 180.34,53.34 X8.C12 182.88,53.34 184.15,54.61 188.59,54.61 SV2.24
PI_TXD
  Top 0.406: SV1.23 X1.A12 16.51,53.34 17.78,52.07 20.32,52.07 21.59,53.34 X2.A12 41.91,53.34 43.18,52.07 45.72,52.07 46.99,53.34 X3.A12 62.23,53.34 63.5,52.07 66.04,52.07 67.31,53.34 X4.A12 87.63,53.34 88.9,52.07 91.44,52.07 92.71,53.34 X5.A12 107.95,53.34 109.22,52.07 111.76,52.07 113.03,53.34 X6.A12 133.35,53.34 134.62,52.07 137.16,52.07 138.43,53.34 X7.A12 153.67,53.34 154.94,52.07 157.48,52.07 158.75,53.34 X8.A12 179.07,53.34 180.34,52.07 182.88,52.07 184.15,53.34 SV2.23
SPI_CE0
  Top 0.406: SV1.19 X1.A10 16.51,58.42 17.78,57.15 20.32,57.15 21.59,58.42 X2.A10 41.91,58.42 43.18,57.15 45.72,57.15 46.99,58.42 X3.A10 62.23,58.42 63.5,57.15 66.04,57.15 67.31,58.42 X4.A10 87.63,58.42 88.9,57.15 91.44,57.15 92.71,58.42 X5.A10 107.95,58.42 109.22,57.15 111.76,57.15 113.03,58.42 X6.A10 133.35,58.42 134.62,57.15 137.16,57.15 138.43,58.42 X7.A10 153.67,58.42 154.94,57.15 157.48,57.15 158.75,58.42 X8.A10 179.07,58.42 180.34,57.15 182.88,57.15 184.15,58.42 SV2.19
SPI_CE1
  Top 0.406: SV1.22 6.35,57.15 16.51,57.15 17.78,55.88 X1.C11 20.32,55.88 21.59,57.15 41.91,57.15 43.18,55.88 X2.C11 45.72,55.88 46.99,57.15 62.23,57.15 63.5,55.88 X3.C11 66.04,55.88 67.31,57.15 87.63,57.15 88.9,55.88 X4.C11 91.44,55.88 92.71,57.15 107.95,57.15 109.22,55.88 X5.C11 111.76,55.88 113.03,57.15 133.35,57.15 134.62,55.88 X6.C11 137.16,55.88 138.43,57.15 153.67,57.15 154.94,55.88 X7.C11 157.48,55.88 158.75,57.15 179.07,57.15 180.34,55.88 X8.C11 182.88,55.88 184.15,57.15 188.59,57.15 SV2.22
SPI_MISO
  Top 0.406: SV1.17 X1.A9 16.51,60.96 17.78,59.69 20.32,59.69 21.59,60.96 X2.A9 41.91,60.96 43.18,59.69 45.72,59.69 46.99,60.96 X3.A9 62.23,60.96 63.5,59.69 66.04,59.69 67.31,60.96 X4.A9 87.63,60.96 88.9,59.69 91.44,59.69 92.71,60.96 X5.A9 107.95,60.96 109.22,59.69 111.76,59.69 113.03,60.96 X6.A9 133.35,60.96 134.62,59.69 137.16,59.69 138.43,60.96 X7.A9 153.67,60.96 154.94,59.69 157.48,59.69 158.75,60.96 X8.A9 179.07,60.96 180.34,59.69 182.88,59.69 184.15,60.96 SV2.17
SPI_MOSI
  Top 0.406: SV1.18 6.35,62.23 16.51,62.23 17.78,60.96 X1.C9 20.32,60.96 21.59,62.23 41.91,62.23 43.18,60.96 X2.C9 45.72,60.96 46.99,62.23 62.23,62.23 63.5,60.96 X3.C9 66.04,60.96 67.31,62.23 87.63,62.23 88.9,60.96 X4.C9 91.44,60.96 92.71,62.23 107.95,62.23 109.22,60.96 X5.C9 111.76,60.96 113.03,62.23 133.35,62.23 134.62,60.96 X6.C9 137.16,60.96 138.43,62.23 153.67,62.23 154.94,60.96 X7.C9 157.48,60.96 158.75,62.23 179.07,62.23 180.34,60.96 X8.C9 182.88,60.96 184.15,62.23 188.59,62.23 SV2.18
SPI_SCLK
  Top 0.406: SV1.20 6.35,59.69 16.51,59.69 17.78,58.42 X1.C10 20.32,58.42 21.59,59.69 41.91,59.69 43.18,58.42 X2.C10 45.72,58.42 46.99,59.69 62.23,59.69 63.5,58.42 X3.C10 66.04,58.42 67.31,59.69 87.63,59.69 88.9,58.42 X4.C10 91.44,58.42 92.71,59.69 107.95,59.69 109.22,58.42 X5.C10 111.76,58.42 113.03,59.69 133.35,59.69 134.62,58.42 X6.C10 137.16,58.42 138.43,59.69 153.67,59.69 154.94,58.42 X7.C10 157.48,58.42 158.75,59.69 179.07,59.69 180.34,58.42 X8.C10 182.88,58.42 184.15,59.69 188.59,59.69 SV2.20

### Text on the board
tNames: HomePi / Backplane | Rev 2019/04 / (c) Peter Müller